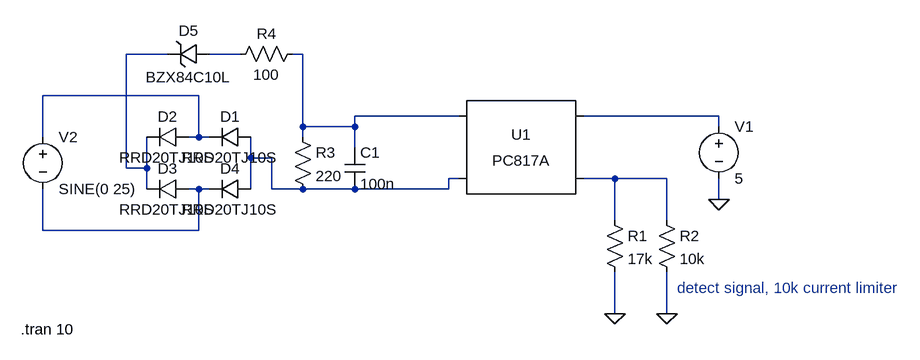
[diagram p0: schematic TSAL_hv_ac_detect.asc]
TSAL_hv_ac_detect.asc, the LTspice schematic file:
Version 4
SHEET 1 880 680
WIRE -336 32 -400 32
WIRE -224 32 -272 32
WIRE -128 32 -144 32
WIRE -288 96 -528 96
WIRE 112 128 -48 128
WIRE 512 128 304 128
WIRE -128 144 -128 32
WIRE -48 144 -48 128
WIRE -48 144 -128 144
WIRE 512 144 512 128
WIRE -528 160 -528 96
WIRE -288 160 -288 96
WIRE -288 160 -304 160
WIRE -272 160 -288 160
WIRE -128 160 -128 144
WIRE -48 176 -48 144
WIRE -208 192 -208 160
WIRE -176 192 -208 192
WIRE -400 208 -400 32
WIRE -368 208 -368 160
WIRE -368 208 -400 208
WIRE 112 224 96 224
WIRE 352 224 304 224
WIRE 432 224 352 224
WIRE -368 240 -368 208
WIRE -288 240 -304 240
WIRE -272 240 -288 240
WIRE -208 240 -208 192
WIRE -176 240 -176 192
WIRE -128 240 -176 240
WIRE -48 240 -128 240
WIRE 96 240 96 224
WIRE 96 240 -48 240
WIRE 512 256 512 224
WIRE 352 288 352 224
WIRE 432 288 432 224
WIRE -528 304 -528 240
WIRE -288 304 -288 240
WIRE -288 304 -528 304
WIRE 352 432 352 368
WIRE 432 432 432 368
FLAG 352 432 0
FLAG 432 432 0
FLAG 512 256 0
SYMBOL Optos\\PC817A 208 176 R0
SYMATTR InstName U1
SYMBOL voltage 512 128 R0
WINDOW 123 0 0 Left 0
WINDOW 39 0 0 Left 0
SYMATTR InstName V1
SYMATTR Value 5
SYMBOL res 336 272 R0
SYMATTR InstName R1
SYMATTR Value 17k
SYMBOL res 416 272 R0
SYMATTR InstName R2
SYMATTR Value 10k
SYMBOL diode -208 144 R90
WINDOW 0 0 32 VBottom 2
WINDOW 3 32 32 VTop 2
SYMATTR InstName D1
SYMATTR Value RRD20TJ10S
SYMBOL diode -304 144 R90
WINDOW 0 0 32 VBottom 2
WINDOW 3 32 32 VTop 2
SYMATTR InstName D2
SYMATTR Value RRD20TJ10S
SYMBOL diode -304 224 R90
WINDOW 0 0 32 VBottom 2
WINDOW 3 32 32 VTop 2
SYMATTR InstName D3
SYMATTR Value RRD20TJ10S
SYMBOL diode -208 224 R90
WINDOW 0 0 32 VBottom 2
WINDOW 3 32 32 VTop 2
SYMATTR InstName D4
SYMATTR Value RRD20TJ10S
SYMBOL res -144 144 R0
SYMATTR InstName R3
SYMATTR Value 220
SYMBOL cap -64 176 R0
SYMATTR InstName C1
SYMATTR Value 100n
SYMBOL zener -272 16 R90
WINDOW 0 -4 32 VBottom 2
WINDOW 3 36 32 VTop 2
SYMATTR InstName D5
SYMATTR Value BZX84C10L
SYMBOL res -128 16 R90
WINDOW 0 0 56 VBottom 2
WINDOW 3 32 56 VTop 2
SYMATTR InstName R4
SYMATTR Value 100
SYMBOL voltage -528 144 R0
WINDOW 123 0 0 Left 0
WINDOW 39 0 0 Left 0
SYMATTR InstName V2
SYMATTR Value SINE(0 25)
TEXT 448 392 Left 2 ;detect signal, 10k current limiter
TEXT -562 456 Left 2 !.tran 10

The netlist it stands for:
* TSAL_hv_ac_detect.asc
XU1 N003 N006 N005 N007 PC817 Igain=1m
V1 N005 0 5
R1 N007 0 17k
R2 N007 0 10k
D1 N006 N004 RRD20TJ10S
D2 N004 N001 RRD20TJ10S
D3 N008 N001 RRD20TJ10S
D4 N006 N008 RRD20TJ10S
R3 N003 N006 220
C1 N003 N006 100n
D5 N002 N001 BZX84C10L
R4 N003 N002 100
V2 N004 N008 SINE(0 25)
.model D D
.lib standard.dio
* detect signal, 10k current limiter
.tran 10
.lib PC817.sub
.backanno
.end